# EAGLE design FTDIAdapter (EAGLE 6.5.0)
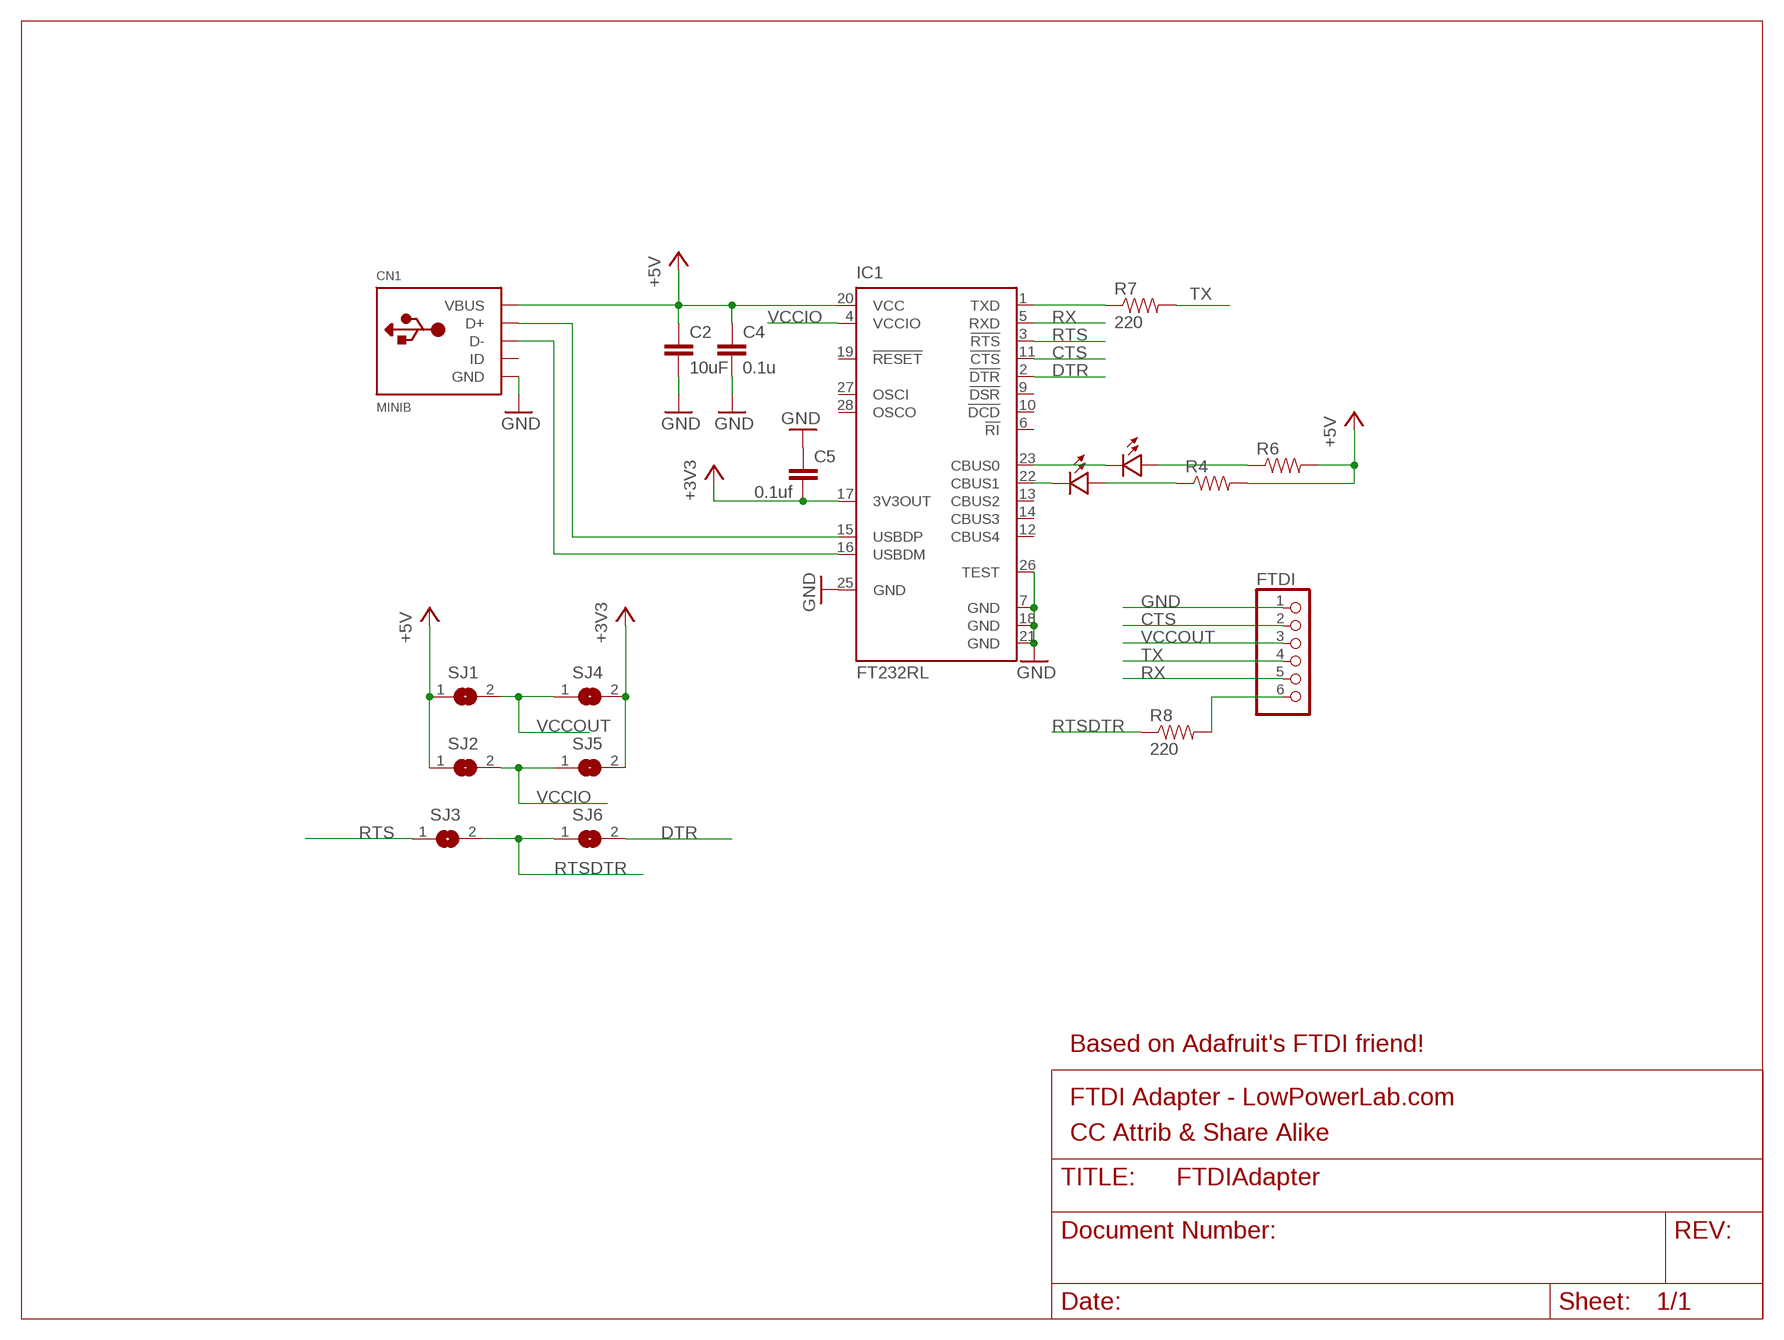
[diagram p0: schematic, sheet 1]

## Parts
C2  10uF  CAP0805-CAP-LARGEPADS  [0805-CAP-LARGEPADS]
C4  0.1u  CAP0603-CAP  [0603-CAP]
C5  0.1uf  CAP0603-CAP  [0603-CAP]
CN1  MINIB  USBMINIB  [USB-MINIB]
FTDI  PINHD-1X6CB  [1X06-CLEANBIG]
IC1  FT232RL  [SSOP28]
R4  RESISTOR0603-RES  [0603-RES]
R6  RESISTOR0603-RES  [0603-RES]
R7  220  RESISTOR0603-RES  [0603-RES]
R8  220  RESISTOR0603-RES  [0603-RES]
SJ1  SJ  [SJ]
SJ2  SJ  [SJ]
SJ3  SJ  [SJ]
SJ4  SJ  [SJ]
SJ5  SJ  [SJ]
SJ6  SJ  [SJ]
U$4  LED0603  [0603-LED]
U$5  LED0603  [0603-LED]

## Nets
+3V3: C5.2 IC1.17(3V3OUT) SJ4.2 SJ5.2
+5V: C2.1 C4.1 CN1.VBUS IC1.20(VCC) R4.2 R6.2 SJ1.1 SJ2.1
CTS: FTDI.2 IC1.11(!CTS)
DTR: IC1.2(!DTR) SJ6.2
GND: C2.2 C4.2 C5.1 CN1.GND FTDI.1 IC1.7(GND) IC1.18(GND) IC1.21(GND) IC1.25(GND) IC1.26(TEST)
N$2: FTDI.6 R8.2
N$3: CN1.D+ IC1.15(USBDP)
N$4: CN1.D- IC1.16(USBDM)
N$5: IC1.1(TXD) R7.1
N$6: IC1.23(CBUS0) U$4.MINUS
N$7: IC1.22(CBUS1) U$5.MINUS
N$8: R4.1 U$5.PLUS
N$9: R6.1 U$4.PLUS
RTS: IC1.3(!RTS) SJ3.1
RTSDTR: R8.1 SJ3.2 SJ6.1
RX: FTDI.5 IC1.5(RXD)
TX: FTDI.4 R7.2
VCCIO: IC1.4(VCCIO) SJ2.2 SJ5.1
VCCOUT: FTDI.3 SJ1.2 SJ4.1
Unconnected: CN1.ID IC1.6(!RI) IC1.9(!DSR) IC1.10(!DCD) IC1.12(CBUS4) IC1.13(CBUS2) IC1.14(CBUS3) IC1.19(!RESET) IC1.27(OSCI) IC1.28(OSCO)

## Notes on the sheet
- Based on Adafruit's FTDI friend!
- FTDI Adapter - LowPowerLab.com
- CC Attrib & Share Alike

## Library data of the parts
C2 C4 C5 = LowPowerLab:CAP: Capacitor Standard 0603 ceramic capacitor, and 0.1" leaded capacitor.
CN1 = adafruit:USB: USB Connectors USBMINIB - Surface Mount Female Mini-B USB Connector 4UConnector: 06564 By microbuilder.eu Thru-hole RA Female Mini-B USB Connector 4UConnector: 18732 By ladyada.net
FTDI = adafruit:PINHD-1X6: PIN HEADER
IC1 = ftdichip:FT232R: Source: http://www.ftdichip.com/Documents/DataSheets/DS_FT232R_v104.pdf
R4 R6-R8 = LowPowerLab:RESISTOR: Resistor Basic schematic elements and footprints for 0603, 1206, and PTH resistors.
SJ1-SJ6 = jumper:SJ: SMD solder JUMPER
U$4 U$5 = LowPowerLab:LED

## Board
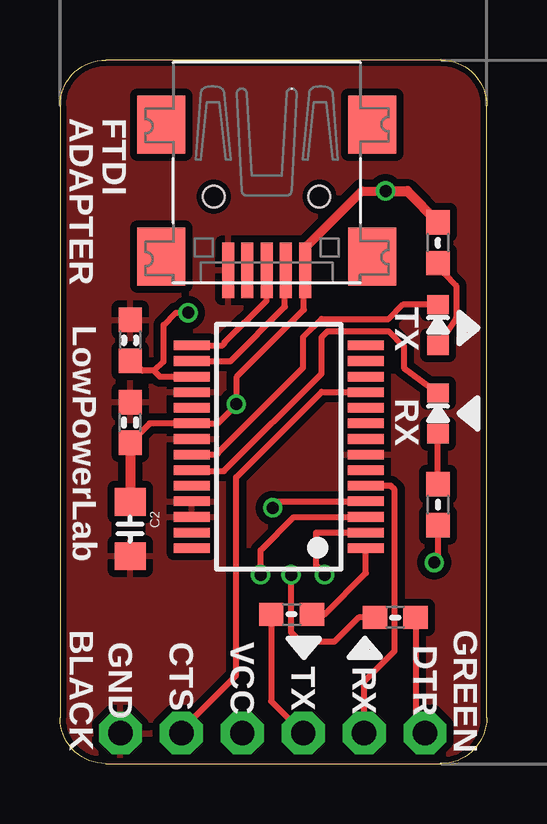
[diagram p1: board, top side]
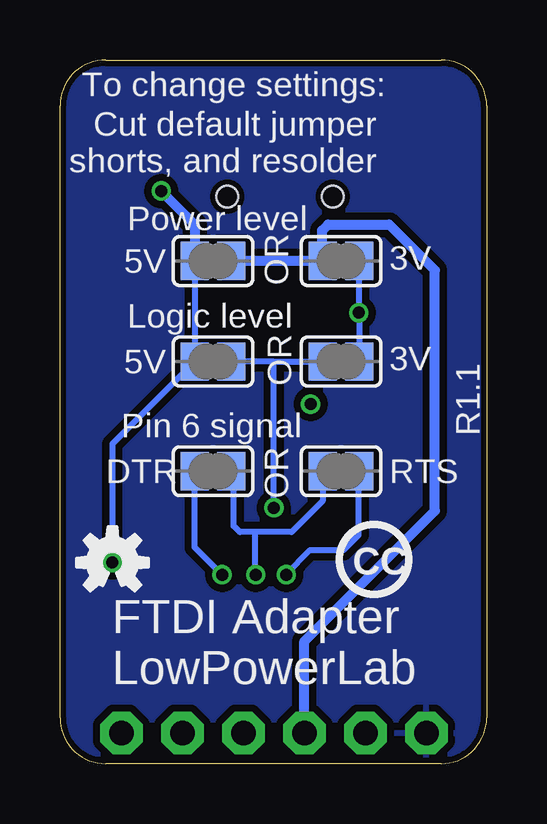
[diagram p2: board, bottom side, seen from below]

Size 17.78 x 29.34 mm. Coordinates in mm from the lower left corner, seen from the top.
Outline: 0,27.43 0,1.91 arc90 1.91,0 15.88,0 arc90 17.78,1.91 17.78,27.43 arc90 15.88,29.34 1.91,29.34 arc90 0,27.43
Copper layers (1*16): Top 0.035mm / dielectric 1.5mm / Bottom 0.035mm
Design rules "ITEADstudio_DRC *": minimum track width 6mil, minimum drill 12mil, track to track 12mil, track to pad 12mil, pad to pad 6mil, via to via 6mil, smd to smd 0mil, copper to edge 10mil, drill to drill 10mil, minimum pad ring 10mil, minimum via ring 6mil, stop-mask expansion 2mil, vias tented up to drill 100mil, thermal gap 12mil
tRestrict: area 2.2,9.4 to 3.6,10.2; area 1.4,0.9 to 1.7,1.5
bRestrict: area 1.4,0.9 to 1.7,1.5

### Footprints (pad centres in the part's own frame; a part is rotated, then mirrored left to right if it is on the bottom)
0805-CAP-LARGEPADS = smd 1.156 x 1.3: 1 -1.127,0; 2 1.127,0
0603-CAP = smd 1.016 x 0.965: 1 -0.85,0; 2 0.85,0
USB-MINIB = smd 0.5 x 2.308: D+ 0,4.064; D- -0.8,4.064; GND 1.6,4.064; ID 0.8,4.064; VBUS -1.6,4.064 | smd 2 x 2.4: GND1 -4.4,-2; GND2 -4.4,3.5; GND3 4.4,3.5; GND4 4.4,-2 | hole 0.9: -2.2,1; 2.2,1
1X06-CLEANBIG = drill 1.016 pad 1.778 octagon: 1 -6.35,0; 2 -3.81,0; 3 -1.27,0; 4 1.27,0; 5 3.81,0; 6 6.35,0
SSOP28 = smd 0.4 x 1.5: 1 -4.225,-3.625; 2 -3.575,-3.625; 3 -2.925,-3.625; 4 -2.275,-3.625; 5 -1.625,-3.625; 6 -0.975,-3.625; 7 -0.325,-3.625; 8 0.325,-3.625; 9 0.975,-3.625; 10 1.625,-3.625; 11 2.275,-3.625; 12 2.925,-3.625; 13 3.575,-3.625; 14 4.225,-3.625; 15 4.225,3.625; 16 3.575,3.625; 17 2.925,3.625; 18 2.275,3.625; 19 1.625,3.625; 20 0.975,3.625; 21 0.325,3.625; 22 -0.325,3.625; 23 -0.975,3.625; 24 -1.625,3.625; 25 -2.275,3.625; 26 -2.925,3.625; 27 -3.575,3.625; 28 -4.225,3.625
0603-RES = smd 1.016 x 0.965: 1 -0.85,0; 2 0.85,0
SJ = smd 1.168 x 1.6: 1 -0.762,0; 2 0.762,0
0603-LED = smd 0.8 x 0.9: MINUS -0.85,0; PLUS 0.85,0

### Placement (x,y rotation side)
C2  2.92,9.78 270 top
C4  2.92,14.22 90 top
C5  2.92,17.65 270 top
CN1  8.61,24.64 180 top
FTDI  8.86,1.27 0 top
IC1  9.12,13.21 90 top
R4  15.75,21.72 90 top
R6  15.75,10.79 270 top
R7  9.65,6.22 180 top
R8  13.97,6.1 0 top
SJ1  11.4,20.95 0 bottom
SJ2  11.4,16.76 0 bottom
SJ3  6.07,12.19 180 bottom
SJ4  6.07,20.95 0 bottom
SJ5  6.07,16.76 0 bottom
SJ6  11.4,12.19 180 bottom
U$3  [OSHW-LOGO-S]  15.6,8.38 0 bottom
U$4  15.75,14.6 270 top
U$5  15.75,18.29 270 top

### Tracks (layer width: path | path; a pad name or v marks a point on that pad's centre or on a via)
+3V3  (via drill 0.5)
  Top 0.254: IC1.17 4.16,16.13 3.91,16.38 | 3.91,16.38 3.43,16.38 2.95,16.87 2.86,16.87 C5.2 | v5.33,18.8 4.83,18.8 4.32,18.29 4.32,16.76 3.94,16.38 3.91,16.38
  Bottom 0.254: 5.31,18.77 SJ4.2 | 5.31,18.77 SJ5.2 | v5.33,18.8 5.31,18.77
+5V  (via drill 0.5)
  Top 0.254: CN1.VBUS 10.16,20.52 10.16,18.92 7.37,16.13 7.37,14.99 v7.34,14.99 7.34,14.96 6.56,14.18 IC1.20 3.73,14.18 C4.1 2.92,13.25 | v13.56,23.88 13.59,23.88 13.61,23.86 | 15.6,8.41 15.62,8.38 v15.6,8.38 15.75,8.48 R6.2
  Top 0.305: 13.59,23.75 13.56,23.77 v13.56,23.88
  Top 0.381: CN1.VBUS 10.21,21.51 12.57,23.88 v13.56,23.88
  Top 0.406: 13.59,23.88 14.48,23.88 R4.2 | 2.92,13.25 C2.1
  Bottom 0.254: v15.6,8.38 15.6,13.33 SJ2.1 12.17,20.93 12.19,20.95 SJ1.1 | 7.34,15.24 v7.34,14.99 7.34,14.86 7.37,14.86
  Bottom 0.406: v13.56,23.88 12.17,22.48 SJ1.1
CTS
  Top 0.254: FTDI.2 5.05,1.4 7.34,3.68 7.34,11.94 10.9,15.49 12.17,15.49 12.18,15.48 IC1.11
DTR  (via drill 0.5)
  Top 0.254: IC1.2 10.67,9.63 10.67,8.25 11.05,7.87 v11.02,7.87
  Bottom 0.254: v11.02,7.87 12.17,9.02 SJ6.2
GND
  pour Top: 18.26,29.46 -0.28,29.46 -0.53,-1.27 18.01,-1.14
  pour Bottom: 18.26,29.46 -0.28,29.46 -0.53,-1.27 18.01,-1.14
N$1
  Bottom 0.254: 5.71,12.19 5.46,12.19
N$2
  Top 0.254: 14.95,1.54 FTDI.6 14.82,1.66 R8.2
N$3
  Top 0.254: CN1.D+ 8.61,19.3 6.83,17.53 6.86,17.53 6.76,17.43 IC1.15
N$4
  Top 0.254: IC1.16 7.11,16.78 9.37,19.05 9.37,20.07 9.41,20.1 CN1.D-
N$5
  Top 0.254: IC1.1 12.74,7.94 11.01,6.21 10.52,6.21 R7.1
N$6
  Top 0.254: IC1.23 5.01,12.23 5.05,12.19 6.83,12.19 10.9,16.26 10.9,17.78 11.15,18.03 13.69,18.03 14.33,17.4 14.33,16.5 U$4.MINUS
N$7
  Top 0.254: IC1.22 6.53,12.88 6.6,12.95 6.58,12.95 10.13,16.51 10.13,17.78 10.9,18.54 13.69,18.54 14.29,19.14 U$5.MINUS
N$8
  Top 0.254: R4.1 16,20.45 16.51,19.94 16.51,18.58 U$5.PLUS
N$9
  Top 0.254: R6.1 U$4.PLUS
N$12
  Bottom 0.254: 6.73,16.76 5.21,16.76
N$13
  Bottom 0.254: 12.06,20.95 10.54,20.95 10.41,21.21
RTS  (via drill 0.5)
  Top 0.254: IC1.3 9.75,10.28 8.36,8.89 v8.36,7.87
  Bottom 0.254: 5.56,12.45 SJ3.1 5.33,12.19 | v8.36,7.87 8.38,7.87 7.37,8.89 5.97,8.89 5.33,9.52 5.33,12.19 | 5.59,12.06 5.46,12.06 5.33,12.19
RTSDTR  (via drill 0.5)
  Top 0.254: v9.63,7.87 9.63,5.46 9.65,5.46 10.03,5.08 11.43,5.08 12.45,6.1 R8.1
  Bottom 0.254: 10.54,12.17 12.19,12.19 | 10.54,12.17 SJ6.1 | v9.63,7.87 9.65,7.9 9.65,9.65 | 9.65,9.65 10.29,9.65 10.54,9.91 10.54,12.17 | SJ3.2 6.83,10.95 8.13,9.65 9.65,9.65
RX
  Top 0.254: FTDI.5 12.68,3.43 13.95,4.7 13.95,11.43 13.79,11.58 IC1.5
TX
  Top 0.254: R7.2 8.8,2.6 FTDI.4
VCCIO  (via drill 0.5)
  Top 0.254: IC1.4 8.88,10.93 v8.87,10.67
  Bottom 0.254: 8.87,16.76 SJ5.1 | 8.87,16.76 SJ2.2 | v8.87,10.67 8.87,16.76
VCCOUT
  Bottom 0.254: 7.34,20.95 7.09,21.21 SJ4.1 6.83,20.83 6.86,20.83
  Bottom 0.406: 7.34,20.95 SJ1.2 | FTDI.3 7.59,5.11 2.16,10.54 2.16,20.57 4.06,22.48 6.6,22.48 6.86,22.22 6.86,20.83

### Text on the board
tPlace: FTDI / ADAPTER | TX | LowPowerLab | RX | BLACK | GREEN | GND | CTS | VCC | DTR | TX | RX
bPlace: To change settings: | Cut default jumper | shorts, and resolder | OR | Power level | 3V | 5V | OR | Logic level | 3V | 5V | R1.1 | Pin 6 signal | OR | RTS | DTR | CC | FTDI Adapter / LowPowerLab